# EAGLE design source_eagle (EAGLE 9.6.2)
AUTHOR: K. TOWNSEND

## Sheet 1 of 2
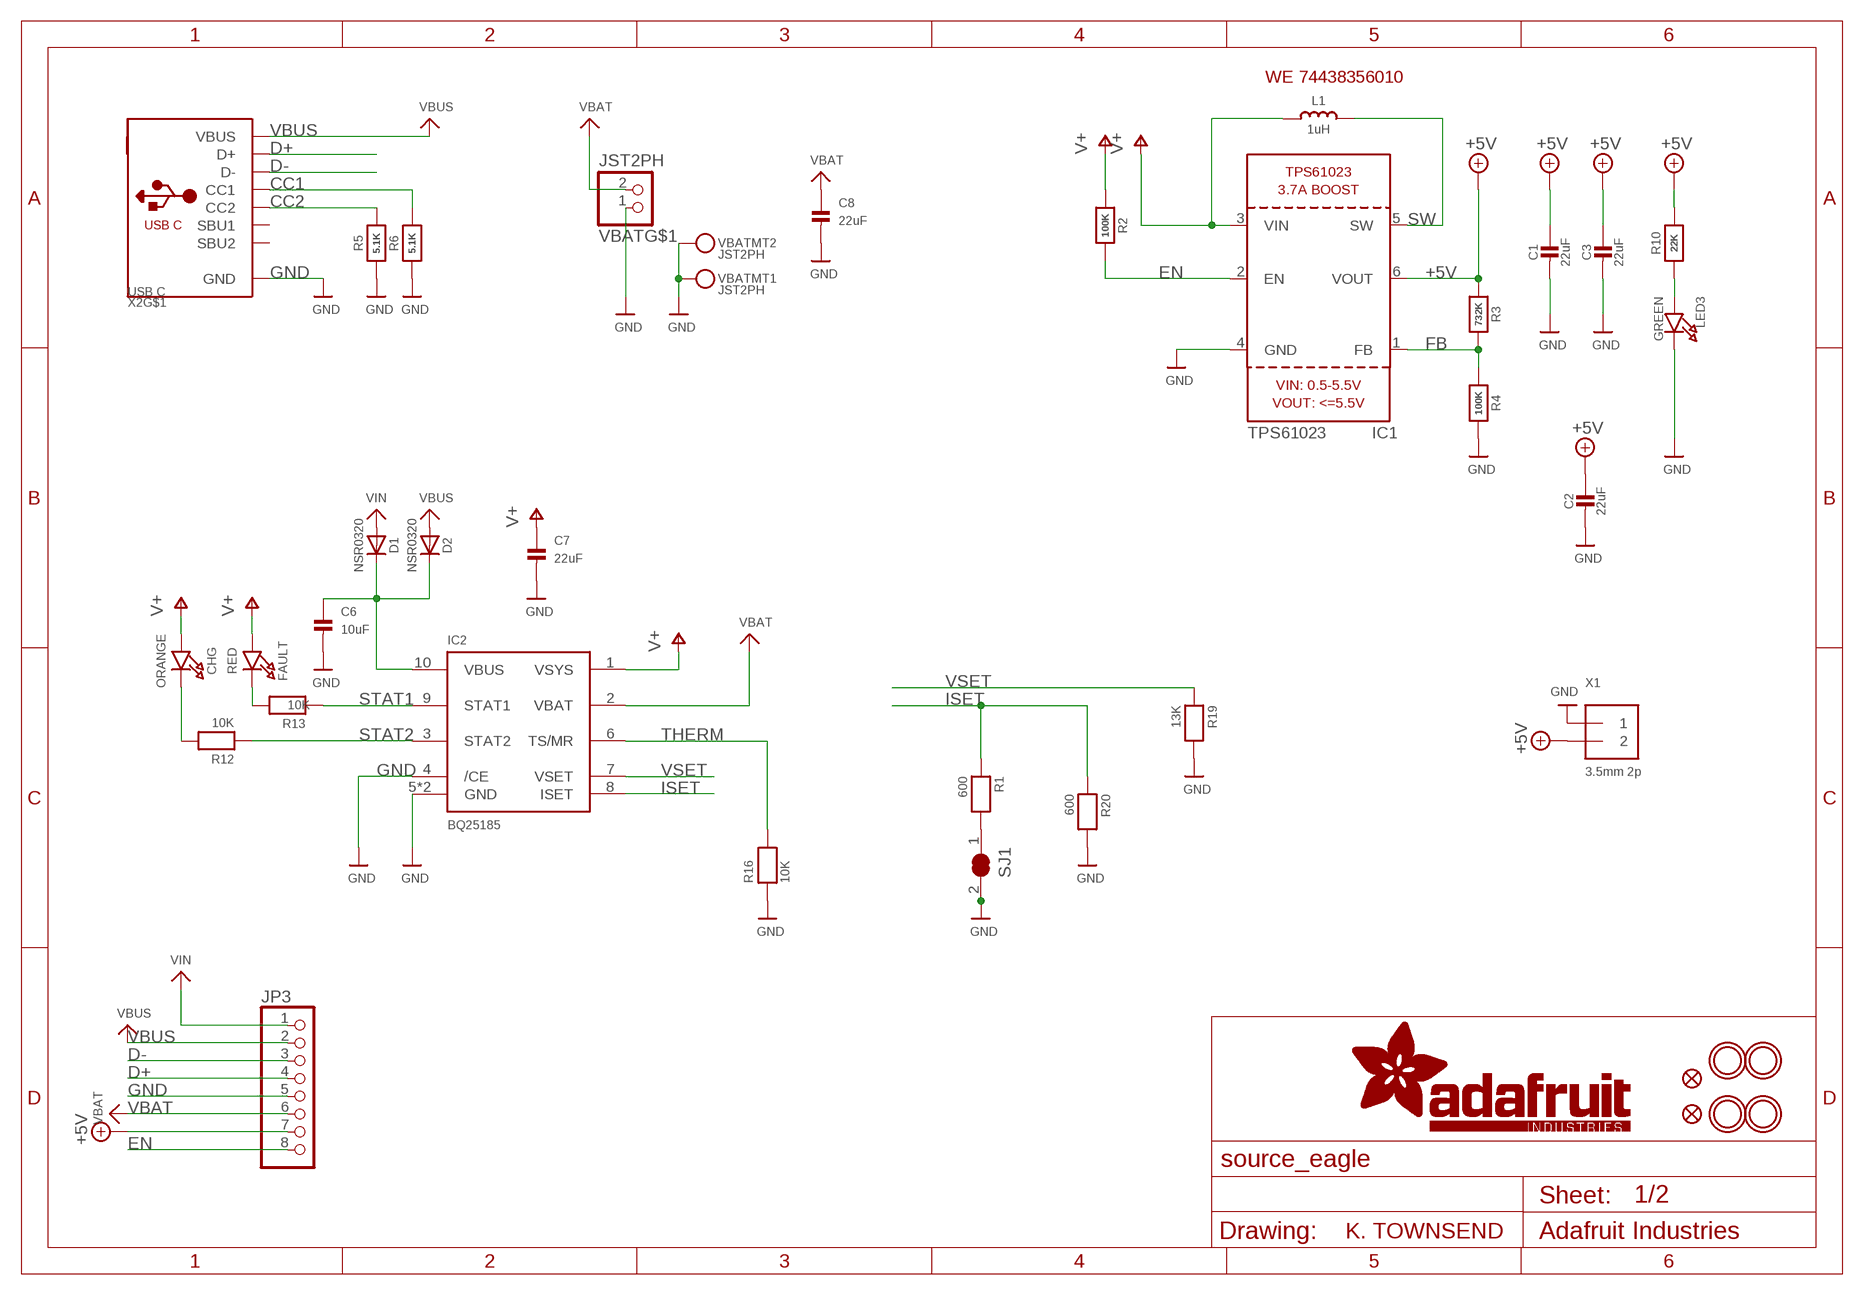
[diagram p0: schematic, sheet 1]

### Parts
C1  22uF  CAP_CERAMIC0805-NOOUTLINE  [0805-NO]
C2  22uF  CAP_CERAMIC0805-NOOUTLINE  [0805-NO]
C3  22uF  CAP_CERAMIC0805-NOOUTLINE  [0805-NO]
C6  10uF  CAP_CERAMIC0805-NOOUTLINE  [0805-NO]
C7  22uF  CAP_CERAMIC0805-NOOUTLINE  [0805-NO]
C8  22uF  CAP_CERAMIC0805-NOOUTLINE  [0805-NO]
CHG  ORANGE  LED0603_NOOUTLINE  [CHIPLED_0603_NOOUTLINE]
D1  NSR0320  DIODE_SOD323MINI  [SOD-323_MINI]
D2  NSR0320  DIODE_SOD323MINI  [SOD-323_MINI]
FAULT  RED  LED0603_NOOUTLINE  [CHIPLED_0603_NOOUTLINE]
FID1  FIDUCIAL_0.5MM  [FIDUCIAL_0.5MM]
FID2  FIDUCIAL_0.5MM  [FIDUCIAL_0.5MM]
IC1  TPS61023  [SOT563]
IC2  BQ25185  [WSON10]
JP3  HEADER-1X870MIL  [1X08_ROUND_70]
L1  1uH  INDUCTOR_5045_SMALLTABS  [INDUCTOR_5045_SMALLTABS]
LED3  GREEN  LED0603_NOOUTLINE  [CHIPLED_0603_NOOUTLINE]
R1  600  RESISTOR_0402NO  [_0402NO]
R2  100K  RESISTOR_0402NO  [_0402NO]
R3  732K  RESISTOR_0402NO  [_0402NO]
R4  100K  RESISTOR_0402NO  [_0402NO]
R5  5.1K  RESISTOR_0402NO  [_0402NO]
R6  5.1K  RESISTOR_0402NO  [_0402NO]
R10  22K  RESISTOR_0402NO  [_0402NO]
R12  10K  RESISTOR_0402NO  [_0402NO]
R13  10K  RESISTOR_0402NO  [_0402NO]
R16  10K  RESISTOR_0402NO  [_0402NO]
R19  13K  RESISTOR_0402NO  [_0402NO]
R20  600  RESISTOR_0402NO  [_0402NO]
SJ1  SOLDERJUMPER_CLOSED  [SOLDERJUMPER_CLOSEDWIRE]
U$9  MOUNTINGHOLE2.5  [MOUNTINGHOLE_2.5_PLATED]
U$10  MOUNTINGHOLE2.5  [MOUNTINGHOLE_2.5_PLATED]
U$11  MOUNTINGHOLE2.5  [MOUNTINGHOLE_2.5_PLATED]
U$12  MOUNTINGHOLE2.5  [MOUNTINGHOLE_2.5_PLATED]
VBAT  JST2PH  CON_JST_PH_2PIN_MT_BATT  [JSTPH2_BATT]
X1  3.5mm 2p  TERMBLOCK_1X2_3.5MM  [TERMBLOCK_1X2-3.5MM]
X2  USB C  USB_C  [USB_C_CUSB31-CFM2AX-01-X]

### Nets
+5V: C1.1 C2.1 C3.1 IC1.6(VOUT) JP3.7 R3.1 R10.2 X1.2
CC1: R6.2 X2.A5(CC1)
CC2: R5.2 X2.B5(CC2)
D+: JP3.4 X2.A6(D+) X2.B6(D+)
D-: JP3.3 X2.A7(D-) X2.B7(D-)
EN: IC1.2(EN) JP3.8 R2.2
FB: IC1.1(FB) R3.2 R4.1
GND: C1.2 C2.2 C3.2 C6.2 C7.2 C8.2 IC1.4(GND) IC2.4(/CE) IC2.5(GND) IC2.PAD(GND) JP3.5 LED3.C R4.2 R5.1 R6.1 R16.1 R19.2 R20.2 SJ1.2 VBAT.1 VBAT.NC1 VBAT.NC2 X1.1 X2.A1B12(GND) X2.B1A12(GND)
ISET: IC2.8(ISET) R1.1 R20.1
N$1: R1.2 SJ1.1
N$2 [power]: C6.1 D1.C D2.C IC2.10(VBUS)
N$7: CHG.C R12.2
N$8: LED3.A R10.1
N$9: FAULT.C R13.2
STAT1: IC2.9(STAT1) R13.1
STAT2: IC2.3(STAT2) R12.1
SW: IC1.5(SW) L1.2
THERM: IC2.6(TS/MR) R16.2
V+: C7.1 CHG.A FAULT.A IC1.3(VIN) IC2.1(VSYS) L1.1 R2.1
VBAT: C8.1 IC2.2(VBAT) JP3.6 VBAT.2
VBUS [power]: D2.A JP3.2 X2.A4B9(VBUS) X2.B4A9(VBUS)
VIN: D1.A JP3.1
VSET: IC2.7(VSET) R19.1
Unconnected: X2.A8(SBU1) X2.B8(SBU2) X2.M1(MT) X2.M2(MT) X2.M3(MT) X2.M4(MT)

### Notes on the sheet
- WE 74438356010

## Sheet 2 of 2
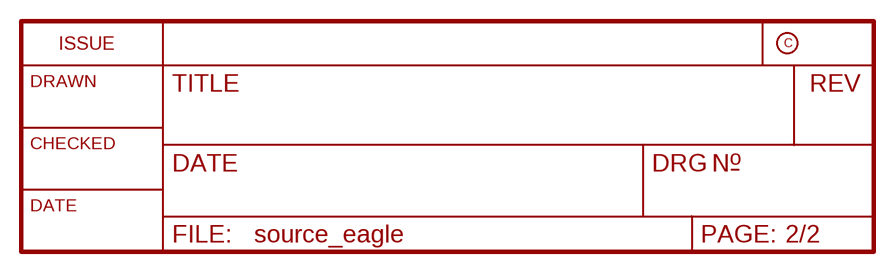
[diagram p1: schematic, sheet 2]

## Library data of the parts
C1-C3 C6-C8 = microbuilder:CAP_CERAMIC: Ceramic Capacitors For new designs, use the packages preceded by an '_' character since they are more reliable: The following footprints should be used on most boards: _0402 - Standard footprint for regular board layouts _0603 - Standard footprint for regular board layouts _0805 - Standard footprint for regular board layouts _1206 - Standard footprint for regular board layouts For extremely tight-pitch boards where space is at a premium, the following 'micro-pitch' footprints can be used (smaller pads, no silkscreen outline, etc.): _0402MP - Micro-pitch footprint for very dense/compact boards _0603MP - Micro-pitch footprint for very dense/compact boards _0805MP - Micro-pitch footprint for very dense/compact boards _1206MP - Micro-pitch footprint for very dense/compact boards
CHG FAULT LED3 = microbuilder:LED: LED 0603 - 0603 Surface Mount Package 2mA: Green LED - Low Power (3.9mcd, 2ma, 1.7Vf) - Digikey: 475-2709-2-ND Orange LED - Low Power (9.8mcd, 2ma, 1.8Vf) - Digikey: 475-1194-2-ND Red LED - Low Power (5mcd, 2ma, 1.8Vf) - Digikey: 475-1195-2-ND Yellow LED - Low Power (7mcd, 2ma, 1.8Vf) - Digikey: 475-1196-2-ND 5mA: Blue LED - Low Power (17mcd, 5ma, 2.9Vf) - Digikey: LNJ937W8CRACT-ND 0805 - 0805 Surface Mount Package 2mA: Red LED (8.8mcd, 2mA, 1.8Vf, Clear) - Low Power [Digikey: 475-2510-1-ND] Green LED (5mcd, 2mA, 1.8Vf, Clear) - Low Power [Digikey: 475-2730-1-ND] Yellow LED (11.3mcd, 2mA, 1.8Vf, Clear) - Low Power [Digikey: 475-2555-1-ND] 20mA: Red LED (104mcd, 20mA, Diffused) - LS R976 [Digikey: 475-1278-6-ND] Red LED (12mcd, 20mA, 2.0Vf, Clear) - APT2012EC [Digikey: 754-1128-1-ND] Green LED (15mcd, 20mA, 2.2Vf, Clear) - APT2012GC [Digikey: 754-1131-1-ND] Orange LED (160mcd, 20mA, 2.1Vf, Clear) - APT2012SECK [Digikey: 754-1130-1-ND] 1206 - 1206 Surface Mount Package Green LED (26mcd, 20mA, Diffused) - LG N971 [Digikey: 475-1407-6-ND] Red LED (15mcd, 20mA, Diffused) - LH N974 [Digikey: 475-1416-6-ND] Cree - Cree High-Power Surface Mount LEDs XPEBWT-L1-0000-00D50 - White 111lm 350mA 2.9Vf 6200K 110° XTEAWT-00-0000-00000LEE3 - White 114lm 350mA 2.85Vf 5000K 115° Everlight - Everlight 45-21 Series Surface Mount LEDs 45-21/QK2C-B2832AC2CB2/2T - Warm White 2000mcd 20mA 3.25Vf 3050K 120° 45-21/LK2C-B38452C4CB2/2T - Nuetral White 2000mcd 20mA 3.25Vf 4150K 120° 45-21/LK2C-B50634C6CB2/2T - Cold White 2200mcd 20mA 3.25Vf 5650K 120° PLCC2 Reverse Mount LS T77K-J1L2-1-0-2-R18-Z - Red 11.25mcd 2mA 1.8Vf 630nm 120° LO T77K-L1M2-24-Z - Orange 19.6mcd 2mA 1.8Vf 606nm 120° LY T77K-K2M1-26-Z - Yellow 15.7mcd 2mA 1.8Vf 587nm 120°; ROT: 270
D1 D2 = microbuilder:DIODE: Diode SMA Model Volts Amps Type Vf Ir Digikey # Notes SSA34-E3 40V 3A Schottky 480mV @ 3A 200uA @ 40V SSA34-E3/61TGITR-ND CDBA120-G 20V 1A Schottky 500mV @ 1A 500uA @ 20V 641-1014-6-ND REEL MBRA210 10V 2A Schottky 350mV @ 2A 700uA @ 10V MBRA210LT3 SOD-123 Model Volts Amps Type Vf Ir Order # Notes BAT54T1G 30V 200mA Schottky 800mV @ 200mA 2uA @ 25V BAT54T1GOSTR-ND B0530W 30V 500mA Schottky 430mV @ 500mA 130uA @ 30V B0530W-FDICT-ND REEL MBR120 20V 1A Schottky 340mV @ 1A MBR120VLSFT1GOSCT-ND SOD-323 Model Volts Amps Type Vf Ir Order # Notes PMEG2005EJ 20V 500mA Schottky 355mV @ 500mA 568-4110-1-ND ZLLS410 10V 570mA Schottky 380mV @ 570mA ZLLS410CT-ND 1N4148WS 75V 150mA Silicon/Simple 1V 1N4148WSFSCT-ND REEL SOD-523 Model Volts Amps Type Vf Ir Order # Notes BAT54XV2 30V 200mA Schottky 0.8V @ 100mA BAT54XV2CT-ND TB751S 30V 30mA Schottky RB751S-40TE61CT-ND SOT23-R/W (R = Solder Paste/Reflow Ovens, W = Hand-Soldering) Model Volts Amps Type Vf Ir Order # Notes BAT54FILM 40V 300mA Schottky 497-7162-1-ND POWERDI-5 Model Volts Amps Type Vf Ir Order # Notes PDS560 60V 5A Schottky 670mV @ 5A 150uA @ 60V PDS560DICT-ND
FID1 FID2 = microbuilder:FIDUCIAL: Fiducial Alignment Points Various fiducial points for machine vision alignment.
IC1 = adafruit_power:TPS61023; ROT: 180
IC2 = microbuilder:BQ25185
JP3 = microbuilder:HEADER-1X8: PIN HEADER
L1 = microbuilder:INDUCTOR: Inductors 0603: 10nH Ceramic Inductor - microwire antenna/RF (Digikey: 712-1434-2-ND) 0805: 560nH Ceramic Inductor - RF (Digikey: 553-1047-1-ND) 270nH Ceramic Inductor - Q = 40@250MHz, +-5%, 1 Ohm DC Resistance (Digikey: 535-10506-2-ND) 1007 (2518 Metric) SMT: 10µH 10% 250mOhm 820mA 1007 Inductor (Digikey: 587-2189-1-ND) 22µH 10% 500mOhm 580mA 1007 Inductor (Digikey: 587-2190-1-ND) 47µH 10% 950mOhm 420mA 1007 Inductor (Digikey: 587-2191-1-ND) 47µH 5% 100mOhm 1A 1008 Inductor (Digikey: 732-1816-1-ND) 5.0x5.0mm (Taiyo Yuden NR5040 Series) 6.8µH 20% 2.3A 64mOhm Inductor (Digikey: 587-2374-2-ND) 5.0x5.0mm (TDK VLC5045 Series) 4.7µH 20% 3.3A 34mOhm Inductor (Digikey: 445-6526-1-ND) 6.8µH 20% 2.7A 46mOhm Inductor (Digikey: 445-6527-1-ND) 6.0x6.0mm (TDK VLC6045 Series) 4.7µH 20% 3.8A 27mOhm Inductor (Digikey: 445-6538-2-ND) 6.8µH 20% 3A 41mOhm Inductor (Digikey: 445-6540-1-ND) 6.2µH 30% 2.2A 45mOhm Inductor (Digikey: SRR5028-6R2YCT-ND) - Not TDK VLC6045 but footprint should match 6.0x6.0mm (TDK SLF6045 Series) 6.8uH 30% 2A 33mOhm Inductor (Digikey: 445-4572-1-ND, Mouser: 810-SLF645T6R8N2R0PF) 6.0x6.0mm (Sumida CDRH5D28 Series) 6.2uH 30% 1.8A 45mOhm Inductor (Digikey: 308-1542-1-ND) Taiyo Yuden NR3015T2R2M - 2.2uH 20% 1.5A (Digikey: 587-1648-2-ND, Mouser: 963-NR3015T2R2M) - Used with TI TPS62172 CoilCraft RFID Transponder Coil - MA5532-AE (For use with AS3935 Lightning Sensor) Taiyo Yuden NRH2412T2R2MNGH - 2.2uH 20% 1AA (Digikey: 587-3443-1-ND) - Used with TI LM3671 Vishay IHLP 1.0uH Molded Inductor - 24mOhm DCR, 5A, +/-20%, -55°C-125°C (Digikey: 541-1319-1-ND)
R1-R6 R10 R12 R13 R16 R19 R20 = microbuilder:RESISTOR: Resistors For new designs, use the packages preceded by an '_' character since they are more reliable: The following footprints should be used on most boards: _0402 - Standard footprint for regular board layouts _0603 - Standard footprint for regular board layouts _0805 - Standard footprint for regular board layouts _1206 - Standard footprint for regular board layouts For extremely tight-pitch boards where space is at a premium, the following 'micro-pitch' footprints can be used (smaller pads, no silkscreen outline, etc.): _0402MP - Micro-pitch footprint for very dense/compact boards _0603MP - Micro-pitch footprint for very dense/compact boards _0805MP - Micro-pitch footprint for very dense/compact boards _1206MP - Micro-pitch footprint for very dense/compact boards
SJ1 = microbuilder:SOLDERJUMPER_CLOSED: Solder Jumper - Closed These solder jumpers are closed by default CLOSEDWIRE - 10 mil trace between pads that can be cut and resoldered later CLOSEDPERM - 63 mil trace between pads for a permanent connection (used to 'bridge' two signals, a shameless hack for Eagle). Can double as a test point as well (no cream layer)
U$9-U$12 = adafruit_electromech:MOUNTINGHOLE: Mounting Hole For #2 screws (0.086"/2.18mm width, 0.094"/2.4mm hole) use 2.5mm; BOM: EXCLUDE
VBAT = adafruit_electromech:CON_JST_PH_2PIN_MT; LCSC: C47647
X1 = adafruit_electromech:TERMBLOCK_1X2: 3.5mm Terminal block http://www.ladyada.net/library/pcb/eaglelibrary.html; ROT: 180
X2 = adafruit_electromech:USB_C: USB Type-C USB 2.0 Connector; LCSC: C165948

## Net classes
1 power: width 0.305 mm, drill 0.381 mm

## Board
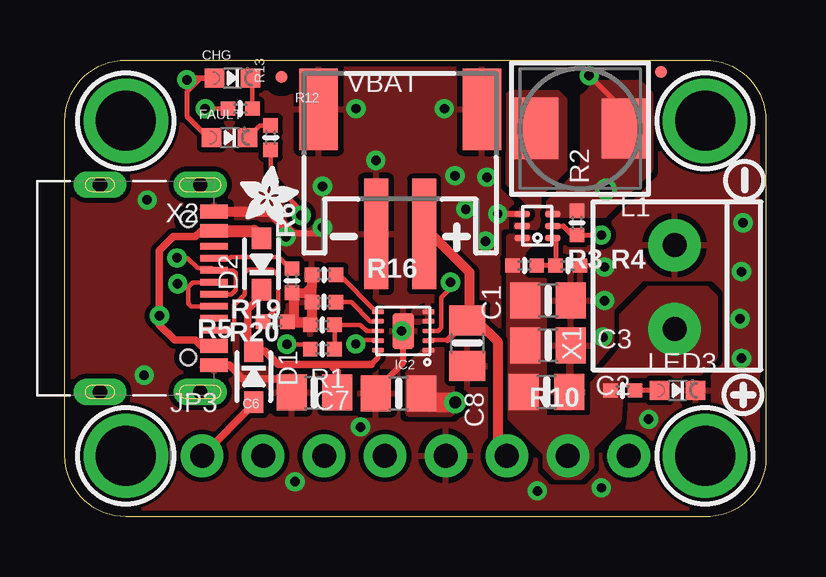
[diagram p2: board, top side]
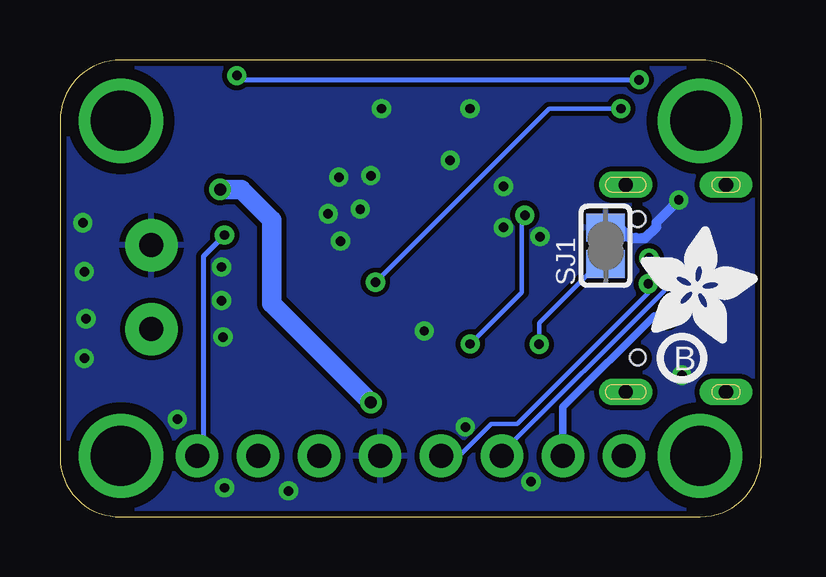
[diagram p3: board, bottom side, seen from below]

Size 29.21 x 19.05 mm. Coordinates in mm from the lower left corner, seen from the top.
Outline: 2.54,19.05 26.67,19.05 arc-90 29.21,16.51 29.21,2.41 arc-90 26.67,0 2.54,0 arc-90 0,2.54 0,16.51 arc-90 2.54,19.05
Copper layers (1*16): Top 0.035mm / dielectric 1.5mm / Bottom 0.035mm
Design rules "adafruit 7-7": minimum track width 7mil, minimum drill 15.5mil, track to track 8mil, track to pad 7mil, pad to pad 7mil, via to via 7mil, smd to smd 7mil, copper to edge 10mil, drill to drill 8mil, minimum pad ring 10mil, minimum via ring 8mil, stop-mask expansion 2mil, vias tented up to drill 20mil, thermal gap 10mil

### Footprints (pad centres in the part's own frame; a part is rotated, then mirrored left to right if it is on the bottom)
0805-NO = smd 1.24 x 1.5: 1 -0.95,0; 2 0.95,0
CHIPLED_0603_NOOUTLINE = smd 0.8 x 0.8: A 0,-0.75; C 0,0.75
SOD-323_MINI = smd 0.9 x 0.8: A 1.07,0; C -1.07,0
FIDUCIAL_0.5MM = smd 0.5 x 0.5: 1 0,0
SOT563 = smd 0.65 x 0.275: 1 -0.635,0.5; 2 -0.635,0; 3 -0.635,-0.5; 4 0.635,-0.5; 5 0.635,0; 6 0.635,0.5
WSON10 = smd 0.5 x 0.2: 1 -1.05,0.8; 2 -1.05,0.4; 3 -1.05,0; 4 -1.05,-0.4; 5 -1.05,-0.8; 6 1.05,-0.8; 7 1.05,-0.4; 8 1.05,0; 9 1.05,0.4; 10 1.05,0.8 | smd 0.9 x 1.5: PAD 0,0
1X08_ROUND_70 = drill 1 pad 1.778: 1 -8.89,0; 2 -6.35,0; 3 -3.81,0; 4 -1.27,0; 5 1.27,0; 6 3.81,0; 7 6.35,0; 8 8.89,0
INDUCTOR_5045_SMALLTABS = smd 2 x 2.5: 1 -1.9,0 | smd 2 x 2.55: 2 1.9,0
_0402NO = smd 0.6 x 0.6: 1 -0.508,0; 2 0.508,0
SOLDERJUMPER_CLOSEDWIRE = smd 1.168 x 1.6: 1 -0.762,0; 2 0.762,0 | smd 0.635 x 0.203: WIRE 0,0
MOUNTINGHOLE_2.5_PLATED = drill 2.5 pad 3.2: P$1 0,0
JSTPH2_BATT = smd 1 x 4.6: 1 -1,-2.303; 2 1,-2.303 | smd 1.6 x 3.4: NC1 -3.4,2.897; NC2 3.4,2.897
TERMBLOCK_1X2-3.5MM = drill 1 pad 2.184: 1 1.8,0; 2 -1.7,0
USB_C_CUSB31-CFM2AX-01-X = smd 0.575 x 1.15: A1B12 -3.2,2.275; A4B9 -2.4,2.275; B1A12 3.2,2.275; B4A9 2.4,2.275 | smd 0.275 x 1.15: A5 -1.25,2.275; A6 -0.25,2.275; A7 0.25,2.275; A8 1.25,2.275; B5 1.75,2.275; B6 0.75,2.275; B7 -0.75,2.275; B8 -1.75,2.275 | drill 0.6 pad 1 long: M1 -4.32,1.7; M2 4.32,1.7; M3 -4.32,-2.48; M4 4.32,-2.48 | hole 0.65: 2.89,1.2; -2.89,1.2

### Placement (x,y rotation side)
C1  20.13,9.02 0 top
C2  20.07,5.21 0 top
C3  20.13,7.15 0 top
C6  10.4,5.18 180 top
C7  13.91,5.14 180 top
C8  16.76,7.24 270 top
CHG  6.99,18.29 270 top
D1  7.87,5.84 270 top
D2  8.19,10.54 90 top
FAULT  6.86,15.81 270 top
FID1  24.83,18.54 0 top
FID2  9.02,18.35 0 top
IC1  19.68,12.13 180 top
IC2  14.1,7.75 180 top
JP3  14.61,2.54 0 top
L1  21.46,16.19 180 top
LED3  25.53,5.27 270 top
PLABEL0  [PLABEL0]  5.78,0.89 0 top
PLABEL1  [PLABEL1]  8.26,0.89 0 top
PLABEL2  [PLABEL2]  10.79,0.89 0 top
PLABEL3  [PLABEL3]  13.34,0.89 0 top
PLABEL4  [PLABEL4]  16,0.89 0 top
PLABEL5  [PLABEL5]  18.54,0.89 0 top
PLABEL6  [PLABEL6]  21.08,0.89 0 top
PLABEL7  [PLABEL7]  23.62,0.89 0 top
PLABEL8  [PLABEL8]  5.02,18.29 0 top
PLABEL9  [PLABEL9]  5.14,15.75 0 top
PLABEL10  [PLABEL10]  24.32,4.19 0 top
PLABEL12  [PLABEL12]  24.13,7.49 0 bottom
PLABEL13  [PLABEL13]  24.13,10.79 0 bottom
PLABEL16  [PLABEL16]  20.95,3.68 90 bottom
PLABEL17  [PLABEL17]  23.5,3.68 90 bottom
PLABEL18  [PLABEL18]  18.41,3.56 90 bottom
PLABEL19  [PLABEL19]  15.88,3.56 90 bottom
PLABEL20  [PLABEL20]  13.34,3.68 90 bottom
PLABEL21  [PLABEL21]  10.79,3.68 90 bottom
PLABEL22  [PLABEL22]  8.26,3.68 90 bottom
PLABEL23  [PLABEL23]  6.86,4.06 0 bottom
PLABEL24  [PLABEL24]  24.51,13.84 0 bottom
PLABEL25  [PLABEL25]  15.49,10.03 0 bottom
PLABEL26  [PLABEL26]  24.38,0.25 0 bottom
R1  10.73,6.99 180 top
R2  21.34,12.26 270 top
R3  19.15,10.48 0 top
R4  20.95,10.48 0 top
R5  8.76,8.13 180 top
R6  9.46,9.84 90 top
R10  23.24,5.27 180 top
R12  7.3,17.02 0 top
R13  8.57,15.81 90 top
R16  10.79,10.1 0 top
R19  10.79,8.95 180 top
R20  10.73,8 180 top
SJ1  6.48,11.3 90 bottom
U$2  [PCBFEAT-REV-040]  3.3,6.6 0 bottom
U$3  [SYMBOL_PLUS]  28.26,5.08 0 top
U$4  [SYMBOL_MINUS]  28.32,14.03 90 top
U$9  26.67,2.54 0 top
U$10  26.67,16.51 0 top
U$11  2.54,2.54 0 top
U$12  2.54,16.51 0 top
U$26  [ADAFRUIT_5MM]  5.02,7.24 0 bottom
U$34  [ADAFRUIT_2.5MM]  7.3,12.19 0 top
VBAT  13.97,14.1 0 top
X1  25.4,9.53 90 top
X2  3.94,9.53 270 top

### Tracks (layer width: path | path; a pad name or v marks a point on that pad's centre or on a via)
+5V
  pour Top (no thermals): 18.48,11.68 18.48,4.19 20,2.67 20,2.1 20.45,1.65 21.47,1.65 21.97,2.15 21.97,2.92 23.11,4.06 23.22,5.84 23.37,5.84 26.35,5.9 27.11,6.67 27.11,9.14 26.73,9.53 24.32,9.53 23.18,8.38 23.18,7 21.97,5.55 21.97,4.25 21.84,4.13 20,4.13 20,9.84 19.24,9.84 19.11,10.67 19.11,11.05 19.37,11.3 19.37,11.62 19.3,11.68
CC1
  Top 0.178: R6.2 9.46,10.29 8.91,10.84 6.91,10.84 6.85,10.78 X2.A5
CC2
  Top 0.178: X2.B5 6.24,7.81 6.83,7.81 7.05,8.03 7.05,8.83 7.49,9.27 7.49,10.16 7.65,10.31 8.64,10.31 8.89,10.06 8.89,8.76 R5.2
D+  (via drill 0.39)
  Top 0.178: X2.B6 5.26,8.78 5.14,8.89 5.14,9.46 | 5.14,9.46 5.14,9.59 5.33,9.78 X2.A6 | 5.14,9.46 4.89,9.72 v4.7,9.72
  Bottom 0.178: v4.7,9.72 4.7,9.34 10.16,3.87 11.24,3.87 12.57,2.54 JP3.4
D-  (via drill 0.39)
  Top 0.178: X2.A7 6.93,9.28 7.11,9.46 7.11,10.16 7,10.28 X2.B7 6.12,10.37 5.53,10.37 5.1,10.79 v4.67,10.79
  Bottom 0.178: v4.67,10.79 4.03,10.16 4.03,9.42 10.79,2.66 JP3.3
EN  (via drill 0.39)
  Top 0.203: IC1.2 20.77,12.13 21.14,11.75 R2.2 v22.35,11.75
  Bottom 0.203: v22.35,11.75 23.24,10.86 23.24,2.79 JP3.8
FB
  Top 0.203: IC1.1 20.45,11.5 R4.1 R3.2
GND  (via drill 0.39)
  Top 0.254: C7.2 12.96,5.27 14.1,6.41 IC2.PAD | v10.73,12.06 10.48,11.81 9.44,11.81 | IC1.4 18.04,12.63 v18.03,12.64
  Top 0.305: 9.26,5.3 9.26,5.75 7.42,5.75 6.85,6.33 X2.B1A12
  Top 0.406: X2.B1A12 6.59,6.33 | 9.26,5.3 9.38,5.18 C6.2 | 17.91,17.4 17.72,17.59 17.37,17.24 VBAT.NC2 17.37,15.65 17.46,15.56 | X2.A1B12 8.53,12.72 9.44,11.81 | R16.1 10.29,9.59 | 10.29,9.59 10.03,9.34 R6.1 9.53,9.27 9.53,8.13 | R5.1 9.53,8.13 | 9.53,8.13 10.1,8.13 | 10.1,8.13 10.29,8.13 R19.2 10.29,9.59 | 10.1,8.13 R20.2
  Bottom 0.406: SJ1.2 5.89,12.06 5.46,11.63 5.22,11.63 5.21,11.62 4.83,11.62 4.36,12.09 4.36,12.28 v3.43,13.21
  other vias: 12.95,14.86 10.73,13.78 3.3,5.91 9.59,1.46 28.19,6.6 14.03,7.75 15.81,17.02 12.13,17.02 9.21,11.68 12.32,3.75 17.59,14.16 17.53,11.49 16.7,12.83 16.26,14.22 28.13,8.26 28.19,10.22 28.26,12.26 22.42,7.49 22.48,9.02 22.35,1.21 24.32,4.06 22.48,10.41 19.68,1.08
  pour Top (isolate 0.203, rank 6): 0,0 0,19.05 29.21,19.05 29.21,0
  pour Bottom (isolate 0.203): 0,19.05 29.21,19.05 29.21,0 0,0
ISET
  Top 0.178: IC2.8 12.57,7.75 12.31,8 R20.1 R1.1
N$1  (via drill 0.39)
  Top 0.178: R1.2 10.22,7.04 10.07,7.2 v9.25,7.2
  Bottom 0.178: v9.25,7.2 9.25,8.08 6.79,10.54 SJ1.1
N$2
  Top 0.203: 12.76,6.35 13.05,6.63 IC2.10
  Top 0.305: D2.C 8.19,9.22 7.62,8.65 7.62,7.17 D1.C 8.32,6.91 8.88,6.35 11.05,6.35 | 11.05,6.35 11.35,6.05 C6.1 | 11.05,6.35 12.76,6.35
N$7
  Top 0.178: CHG.C 7.75,18.28 7.61,18.28 7.81,18.07 R12.2
N$8
  Top 0.203: LED3.A R10.1
N$9
  Top 0.178: R13.2 8.12,16.32 FAULT.C
STAT1  (via drill 0.39)
  Top 0.178: IC2.9 13.03,7.37 12.28,7.37 v12.12,7.21 | v9.84,12.57 9.84,12.76 8.57,14.03 R13.1
  Bottom 0.178: v12.12,7.21 9.97,9.36 9.97,12.45 v9.84,12.57
STAT2  (via drill 0.39)
  Top 0.178: IC2.3 15.56,7.75 15.68,7.87 15.68,9.14 16.07,9.53 v16.07,9.78 | v5.84,17.02 R12.1
  Bottom 0.178: v16.07,9.78 8.83,17.02 v5.84,17.02
SW
  pour Top (rank 2, no thermals): 18.8,12.26 19.43,12.26 19.49,12.32 19.49,12.89 18.48,13.91 18.48,17.59 18.61,17.72 20.51,17.72 20.83,17.4 20.83,14.48 19.75,13.4 19.75,12.19 19.49,11.94 18.8,11.94
THERM
  Top 0.178: IC2.6 12.98,8.55 11.43,10.1 R16.2
V+  (via drill 0.39, 0.5)
  Top 0.203: FAULT.A 5.97,15.81 5.1,16.68 5.1,17.74 5.64,18.29 CHG.A 5.14,18.29 v5.08,18.22 | v21.84,18.4 23.36,16.88 L1.1
  Top 0.813: C7.1 15.24,4.76 v16.26,4.76
  Bottom 0.203: v21.84,18.4 21.67,18.22 v5.08,18.22
  Bottom 0.813: v16.26,4.76 20.38,8.89 20.38,12.38 21.65,13.65 v22.54,13.65
  pour Top (rank 3, no thermals): 20.07,12.64 20.07,13.14 21.59,14.67 21.59,17.53 22.16,18.1 23.94,18.1 24.38,17.65 24.38,14.48 22.48,12.57 20.13,12.57
  pour Top (no thermals): 14.99,6.99 16.07,6.99 16.13,6.92 16.13,4.32 16.07,4.25 14.35,4.25 14.29,4.32 14.29,6.29
VBAT
  Top 0.178: IC2.2 15.17,7.37 15.94,7.37
  Top 0.254: C8.1 15.94,7.37
  Top 0.406: VBAT.2 15.26,11.79 16.86,10.19 16.86,8.19 C8.1 17.15,8.19 18.03,7.3 18.03,2.92 JP3.6
VBUS  (via drill 0.39)
  Top 0.305: X2.B4A9 5.68,7.12 5.44,7.37 4.83,7.37 | 4.83,7.37 | 4.83,7.37 4.57,7.37 3.94,8 v3.94,8.38 3.94,11.11 4.51,11.68 4.83,11.68 | 4.83,11.68 5.44,11.68 5.68,11.93 X2.A4B9 | 4.83,11.68
  Top 0.508: X2.A4B9 7.88,11.93 D2.A
  Bottom 0.305: v3.94,8.38 4.45,8.38 8.26,4.57 JP3.2
VIN
  Top 0.305: JP3.1 7.87,4.7 D1.A
VSET
  Top 0.178: IC2.7 12.73,8.15 11.92,8.95 R19.1

### Text on the board
Pinguin_tBackup: C | C | F | F | 5V | VIN | VU | D- | D+ | G | BAT | 5V | EN
Pinguin_bBackup: 3.7V/4.2V LiPoly/LiIon / Battery Charger & 5V Boost / Default 1A charge rate | GND | Cut jumper / for 0.5A -> | 5V Out (1A max) | Vin | VUSB | D- | D+ | GND | VBat | 5V | En | Vin:5~18V Max. Solar OK